# EAGLE design BeagleCap (EAGLE 6.4)
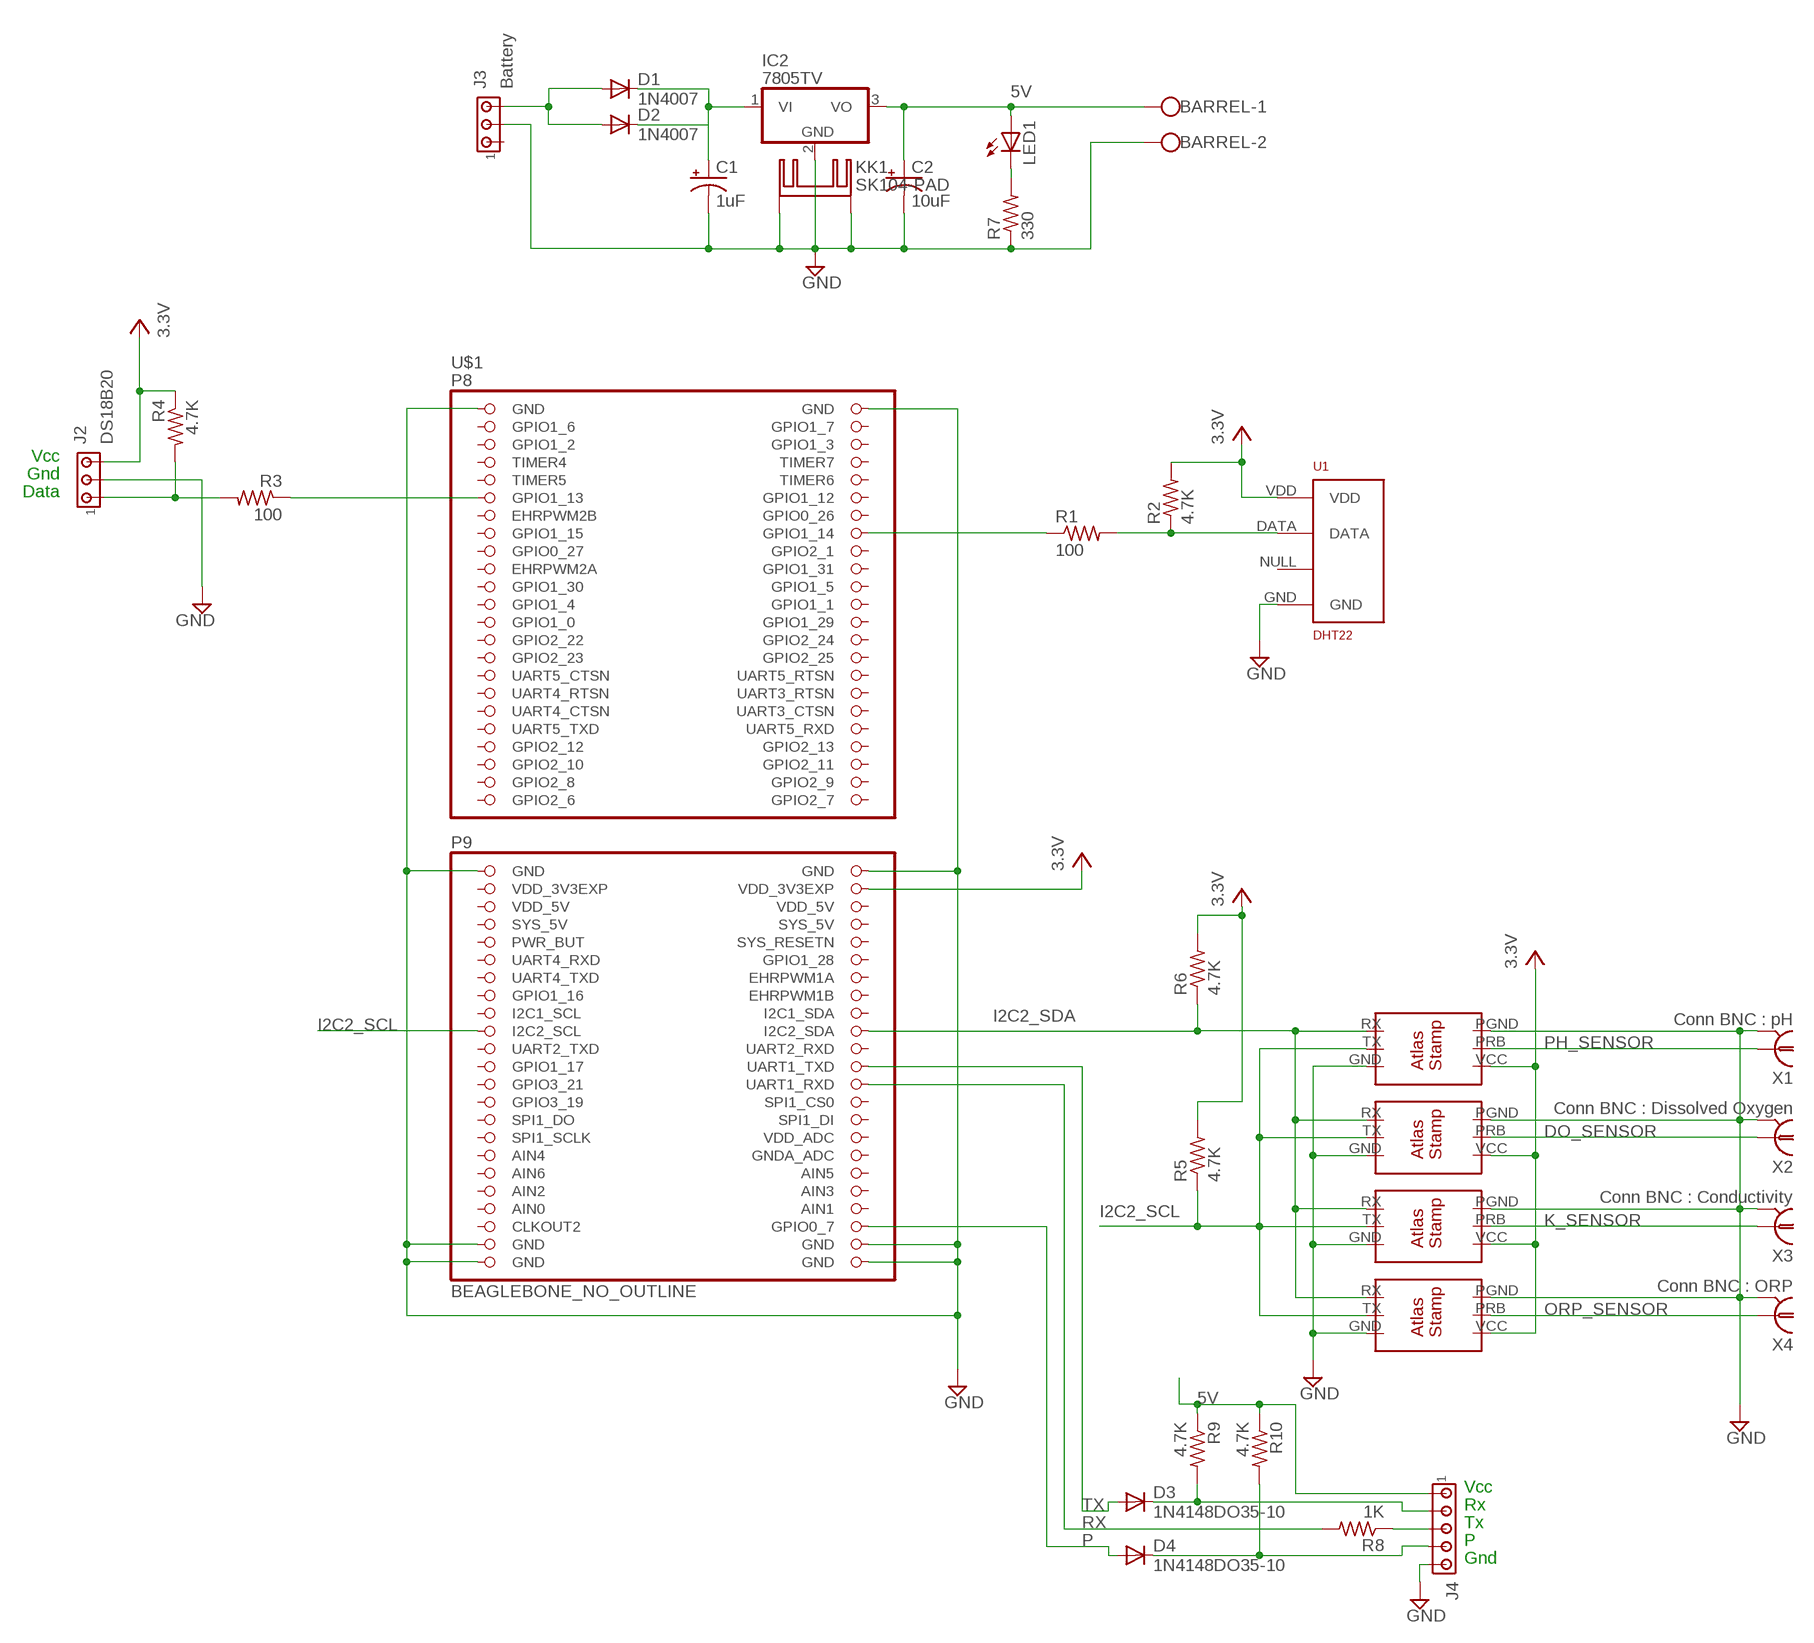
[diagram p0: schematic, sheet 1]

## Parts
BARREL  W237-102  [W237-102]
C1  1uF  CPOL-USE2-5  [E2-5]
C2  10uF  CPOL-USE2-5  [E2-5]
D1  1N4007  1N4004  [DO41-10]
D2  1N4007  1N4004  [DO41-10]
D3  1N4148DO35-10  [DO35-10]
D4  1N4148DO35-10  [DO35-10]
IC2  7805TV  [TO220V]
J2  DS18B20  MTA03-100  [10X03MTA]
J3  Battery  MTA03-100  [10X03MTA]
J4  MTA05-100  [10X05MTA]
KK1  SK104-PAD  [SK104-PAD]
LED1  LED5MM  [LED5MM]
R1  100  R-US_0207/10  [0207/10]
R2  4.7K  R-US_0207/10  [0207/10]
R3  100  R-US_0207/10  [0207/10]
R4  4.7K  R-US_0207/10  [0207/10]
R5  4.7K  R-US_0207/10  [0207/10]
R6  4.7K  R-US_0207/10  [0207/10]
R7  330  R-US_0207/10  [0207/10]
R8  1K  R-US_0207/10  [0207/10]
R9  4.7K  R-US_0207/10  [0207/10]
R10  4.7K  R-US_0207/10  [0207/10]
U1  DHT22  RHT03_DHT-22_AM2302WIRED  [AM2302]
U$1  BEAGLEBONE_NO_OUTLINE  [BEAGLEBONE_SHIELD_NO_OUTLINE]
U$2  ATLAS_STAMP  [ATLAS_STAMP]
U$3  ATLAS_STAMP  [ATLAS_STAMP]
U$4  ATLAS_STAMP  [ATLAS_STAMP]
U$5  ATLAS_STAMP  [ATLAS_STAMP]
X1  Conn BNC : pH  1-227161-0  [AMP_227161]
X2  Conn BNC : Dissolved Oxygen  1-227161-0  [AMP_227161]
X3  Conn BNC : Conductivity  1-227161-0  [AMP_227161]
X4  Conn BNC : ORP  1-227161-0  [AMP_227161]

## Nets
3.3V: J2.3 R2.2 R4.1 R5.2 R6.2 U1.VDD U$1.50(VDD_3V3EXP) U$2.VCC U$3.VCC U$4.VCC U$5.VCC
5V: BARREL.1 C2.+ IC2.3(VO) J4.1 LED1.A R9.1 R10.1
DO_SENSOR: U$3.PRB X2.1
GND: BARREL.2 C1.- C2.- IC2.2(GND) J2.2 J3.2 J4.5 KK1.K1(K) KK1.K2(K) R7.1 U1.GND U$1.1(GND) U$1.2(GND) U$1.47(GND) U$1.48(GND) U$1.89(GND) U$1.90(GND) U$1.91(GND) U$1.92(GND) U$2.GND U$2.PGND U$3.GND U$3.PGND U$4.GND U$4.PGND U$5.GND U$5.PGND X1.2 X2.2 X3.2 X4.2
I2C2_SCL: R5.1 U$1.65(I2C2_SCL) U$2.TX U$3.TX U$4.TX U$5.TX
I2C2_SDA: R6.1 U$1.66(I2C2_SDA) U$2.RX U$3.RX U$4.RX U$5.RX
K_SENSOR: U$4.PRB X3.1
N$1: D1.A D2.A J3.3
N$2: LED1.K(C) R7.2
N$3: R1.2 R2.1 U1.DATA
N$4: R3.1 U$1.11(GPIO1_13)
N$5: J2.1 R3.2 R4.2
N$6: R1.1 U$1.16(GPIO1_14)
N$9: D3.C J4.2 R9.2
N$10: J4.3 R8.1
N$11: D4.C J4.4 R10.2
ORP_SENSOR: U$5.PRB X4.1
P: D4.A U$1.88(GPIO0_7)
PH_SENSOR: U$2.PRB X1.1
RX: R8.2 U$1.72(UART1_RXD)
TX: D3.A U$1.70(UART1_TXD)
VIN: C1.+ D1.C D2.C IC2.1(VI)
Unconnected: J3.1 U1.NULL U$1.3(GPIO1_6) U$1.4(GPIO1_7) U$1.5(GPIO1_2) U$1.6(GPIO1_3) U$1.7(TIMER4) U$1.8(TIMER7) U$1.9(TIMER5) U$1.10(TIMER6) U$1.12(GPIO1_12) U$1.13(EHRPWM2B) U$1.14(GPIO0_26) U$1.15(GPIO1_15) U$1.17(GPIO0_27) U$1.18(GPIO2_1) U$1.19(EHRPWM2A) U$1.20(GPIO1_31) U$1.21(GPIO1_30) U$1.22(GPIO1_5) U$1.23(GPIO1_4) U$1.24(GPIO1_1) U$1.25(GPIO1_0) U$1.26(GPIO1_29) U$1.27(GPIO2_22) U$1.28(GPIO2_24) U$1.29(GPIO2_23) U$1.30(GPIO2_25) U$1.31(UART5_CTSN) U$1.32(UART5_RTSN) U$1.33(UART4_RTSN) U$1.34(UART3_RTSN) U$1.35(UART4_CTSN) U$1.36(UART3_CTSN) U$1.37(UART5_TXD) U$1.38(UART5_RXD) U$1.39(GPIO2_12) U$1.40(GPIO2_13) U$1.41(GPIO2_10) U$1.42(GPIO2_11) U$1.43(GPIO2_8) U$1.44(GPIO2_9) U$1.45(GPIO2_6) U$1.46(GPIO2_7) U$1.54(SYS_5V) U$1.55(PWR_BUT) U$1.56(SYS_RESETN) U$1.57(UART4_RXD) U$1.58(GPIO1_28) U$1.59(UART4_TXD) U$1.60(EHRPWM1A) U$1.61(GPIO1_16) U$1.62(EHRPWM1B) U$1.63(I2C1_SCL) U$1.64(I2C1_SDA) U$1.67(UART2_TXD) U$1.68(UART2_RXD) U$1.69(GPIO1_17) U$1.71(GPIO3_21) U$1.73(GPIO3_19) U$1.74(SPI1_CS0) U$1.75(SPI1_DO) U$1.76(SPI1_DI) U$1.77(SPI1_SCLK) U$1.78(VDD_ADC) U$1.79(AIN4) U$1.80(GNDA_ADC) U$1.81(AIN6) U$1.82(AIN5) U$1.83(AIN2) U$1.84(AIN3) U$1.86(AIN1) U$1.87(CLKOUT2)

## Notes on the sheet
- Vcc
- Gnd
- Data
- Vcc
- Rx
- Tx
- P
- Gnd

## Power pins joined to a net without a drawn wire
AIN0: U$1.85(AIN0)
SYS_5V: U$1.53(SYS_5V)
VDD_3V3EXP: U$1.49(VDD_3V3EXP)
VDD_5V: U$1.51(VDD_5V) U$1.52(VDD_5V)

## Library data of the parts
BARREL = con-wago-500:W237-102: WAGO SCREW CLAMP; MPN: 237-102; OC_FARNELL: unknown; OC_NEWARK: 70K9898
C1 C2 = rcl:CPOL-US: POLARIZED CAPACITOR, American symbol
D1 D2 = diode:1N4004: DIODE general purpose rectifier, 1 A
D3 D4 = diode:1N4148: DIODE high speed (Philips)
IC2 = linear:78*: Positive VOLTAGE REGULATOR Source: http://cache.national.com/ds/LM/LM78L05.pdf http://www.fairchildsemi.com/ds/LM/LM7805.pdf
J2 J3 = con-amp:MTA03-100: AMP connector
J4 = con-amp:MTA05-100: AMP connector
KK1 = heatsink:SK104-PAD: HEATSINK manufacturer Fischer/distributor Buerklin
LED1 = led:LED: LED OSRAM: - CHIPLED LG R971, LG N971, LY N971, LG Q971, LY Q971, LO R971, LY R971 LH N974, LH R974 LS Q976, LO Q976, LY Q976 LO Q996 - Hyper CHIPLED LW Q18S LB Q993, LB Q99A, LB R99A - SideLED LS A670, LO A670, LY A670, LG A670, LP A670 LB A673, LV A673, LT A673, LW A673 LH A674 LY A675 LS A676, LA A676, LO A676, LY A676, LW A676 LS A679, LY A679, LG A679 - Hyper Micro SIDELED® LS Y876, LA Y876, LO Y876, LY Y876 LT Y87S - SmartLED LW L88C, LW L88S LB L89C, LB L89S, LG L890 LS L89K, LO L89K, LY L89K LS L896, LA L896, LO L896, LY L896 - TOPLED LS T670, LO T670, LY T670, LG T670, LP T670 LSG T670, LSP T670, LSY T670, LOP T670, LYG T670 LG T671, LOG T671, LSG T671 LB T673, LV T673, LT T673, LW T673 LH T674 LS T676, LA T676, LO T676, LY T676, LB T676, LH T676, LSB T676, LW T676 LB T67C, LV T67C, LT T67C, LS T67K, LO T67K, LY T67K, LW E67C LS E67B, LA E67B, LO E67B, LY E67B, LB E67C, LV E67C, LT E67C LW T67C LS T679, LY T679, LG T679 LS T770, LO T770, LY T770, LG T770, LP T770 LB T773, LV T773, LT T773, LW T773 LH T774 LS E675, LA E675, LY E675, LS T675 LS T776, LA T776, LO T776, LY T776, LB T776 LHGB T686 LT T68C, LB T68C - Hyper Mini TOPLED® LB M676 - Mini TOPLED Santana® LG M470 LS M47K, LO M47K, LY M47K Source: http://www.osram.convergy.de LUXEON: - LUMILED® LXK2-PW12-R00, LXK2-PW12-S00, LXK2-PW14-U00, LXK2-PW14-V00 LXK2-PM12-R00, LXK2-PM12-S00, LXK2-PM14-U00 LXK2-PE12-Q00, LXK2-PE12-R00, LXK2-PE12-S00, LXK2-PE14-T00, LXK2-PE14-U00 LXK2-PB12-K00, LXK2-PB12-L00, LXK2-PB12-M00, LXK2-PB14-N00, LXK2-PB14-P00, LXK2-PB14-Q00 LXK2-PR12-L00, LXK2-PR12-M00, LXK2-PR14-Q00, LXK2-PR14-R00 LXK2-PD12-Q00, LXK2-PD12-R00, LXK2-PD12-S00 LXK2-PH12-R00, LXK2-PH12-S00 LXK2-PL12-P00, LXK2-PL12-Q00, LXK2-PL12-R00 Source: www.luxeon.com KINGBRIGHT: KA-3528ASYC Source: www.kingbright.com
R1-R10 = adafruit:R-US_: RESISTOR, American symbol
U1 = RHT03_DHT-22_AM2302:RHT03_DHT-22_AM2302: RHT03 / DHT-22 / AM2302 Packages and symbol for the RHT03 / DHT-22 relative humidity and temperature sensor. Note: The AM2302 is a wired version of the DHT-22 which typically requires less clearance and is thus provided as a separate package.; PROD_ID: SEN-10167
U$1 = LEDscape:BEAGLEBONE_NO_OUTLINE: Should match A3 pinout - but not completely tested
U$2-U$5 = LEDscape:ATLAS_STAMP
X1-X4 = con-coax:?227161*: JACK, RIGHT ANGLE, 50 OHM, PCB, BNC Source: amp_227161.pdf; MF: TYCO ELECTRONICS; MPN: 1-227161; OC_FARNELL: unknown; OC_NEWARK: 33B3200

## Board
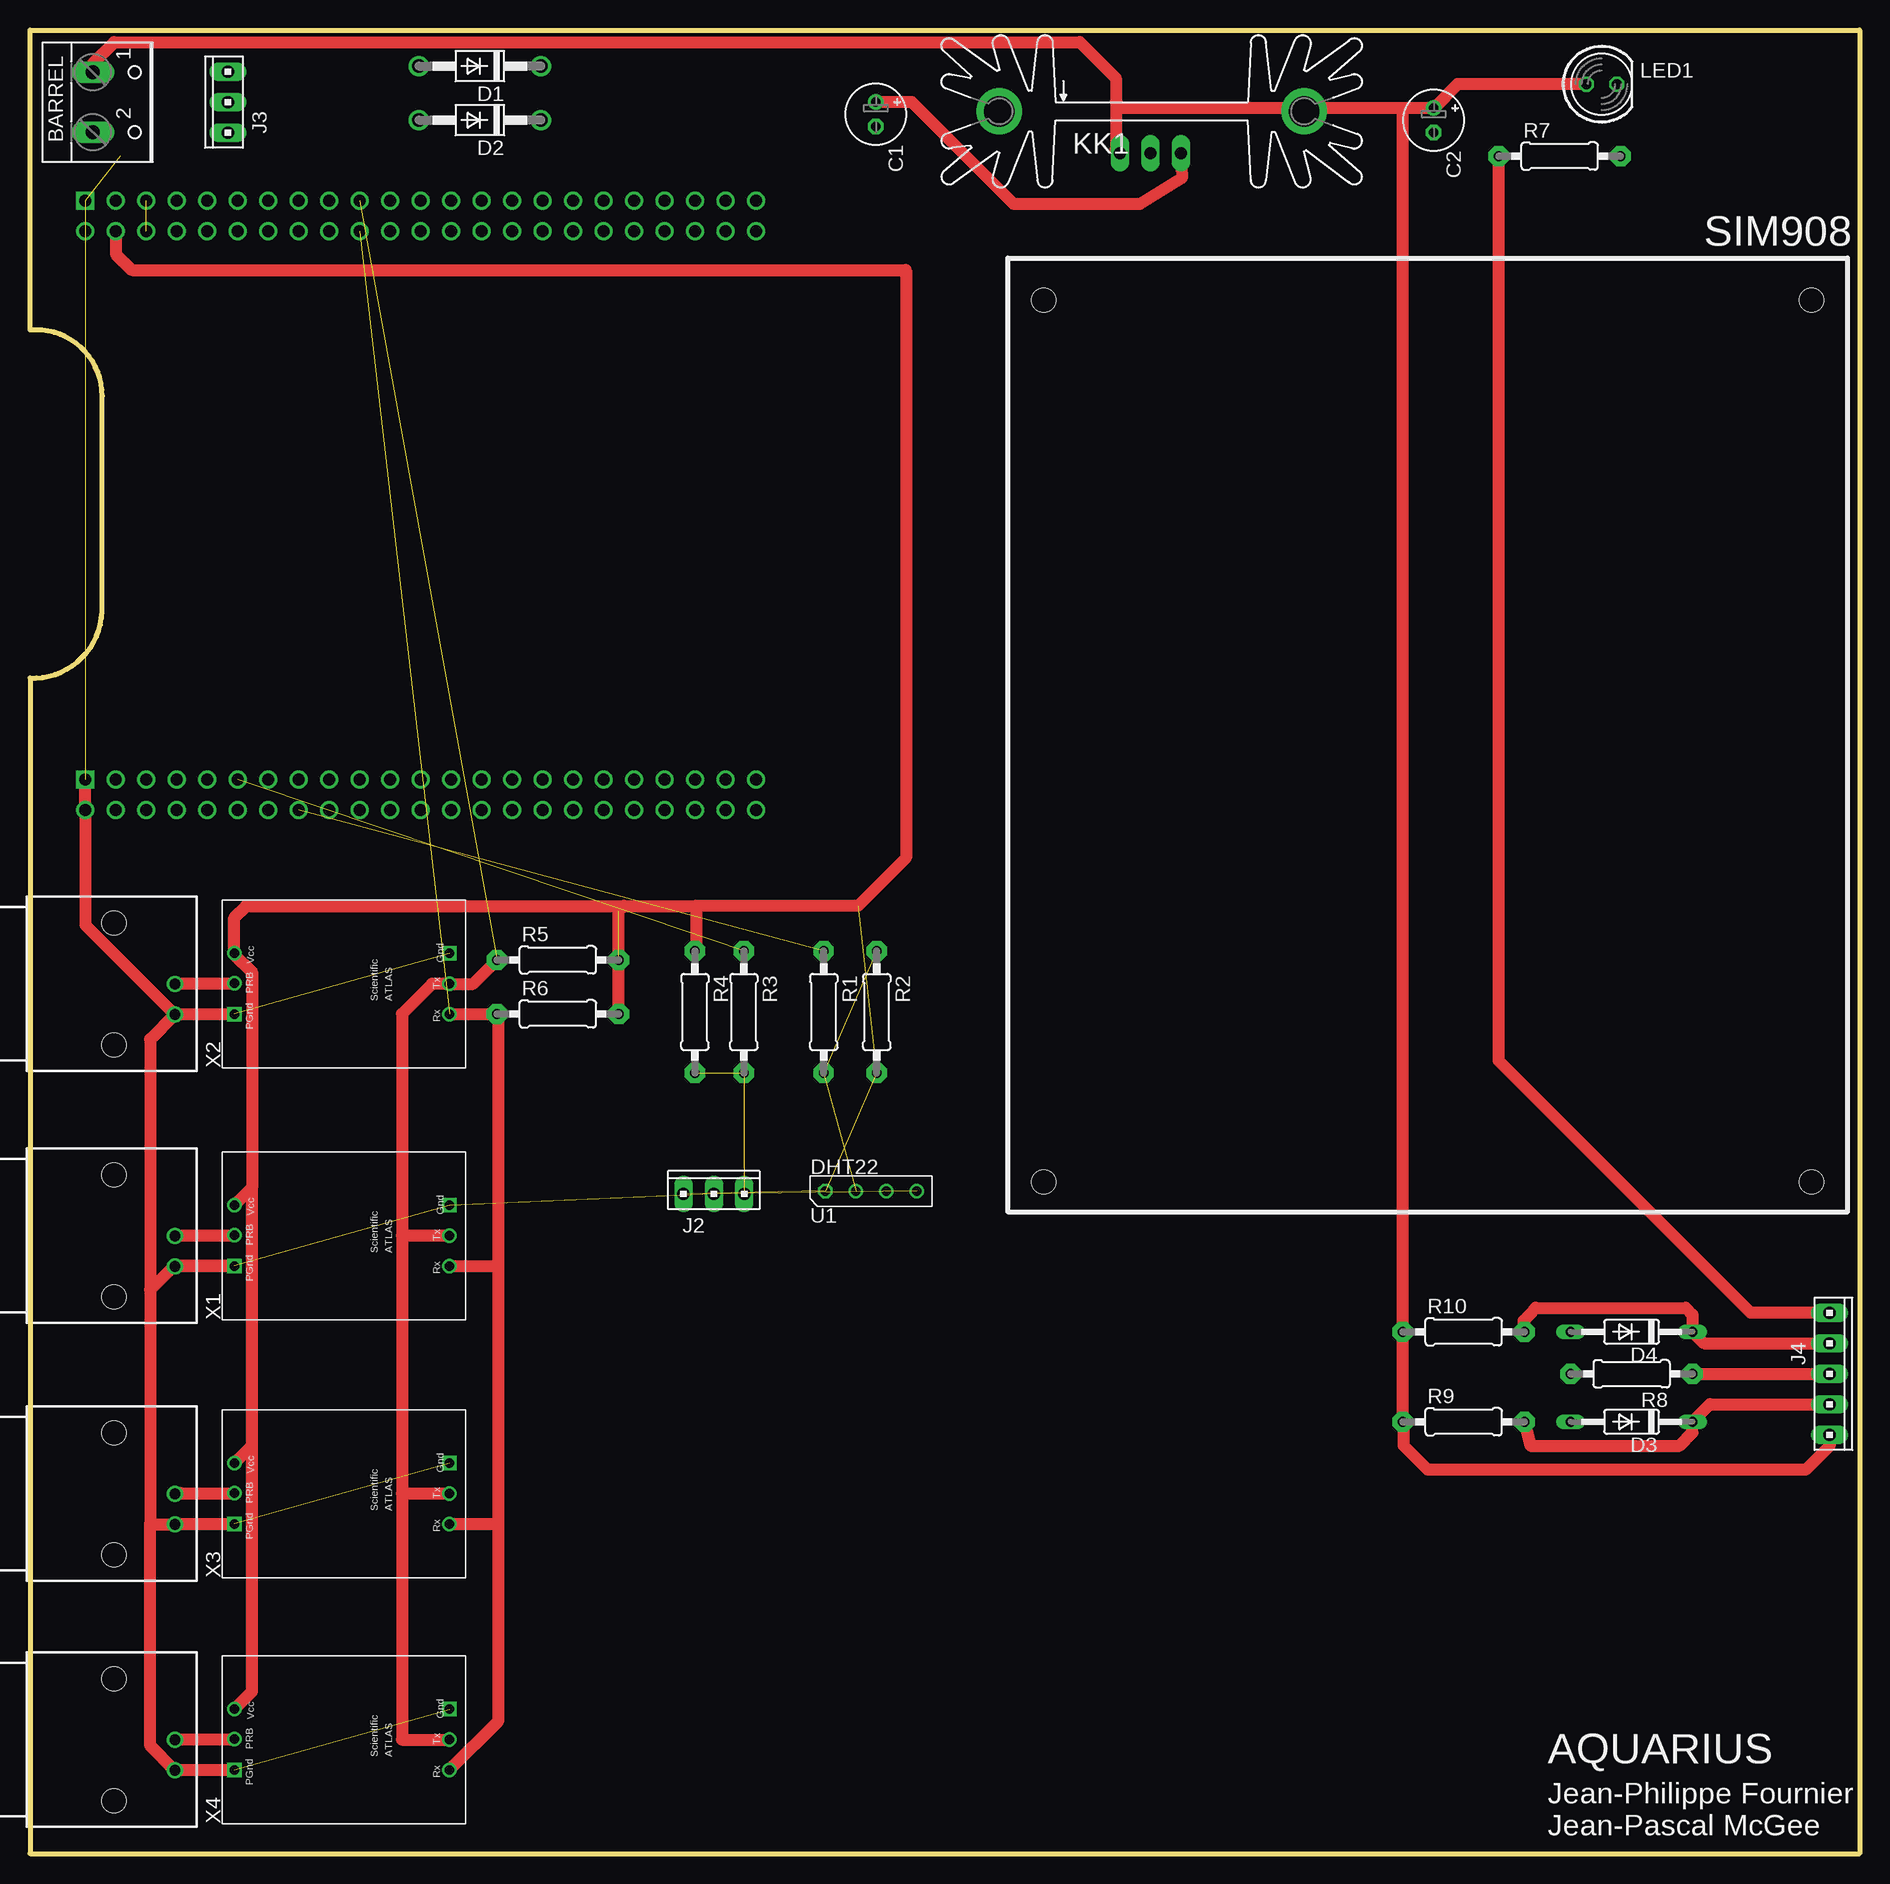
[diagram p1: board, top side]
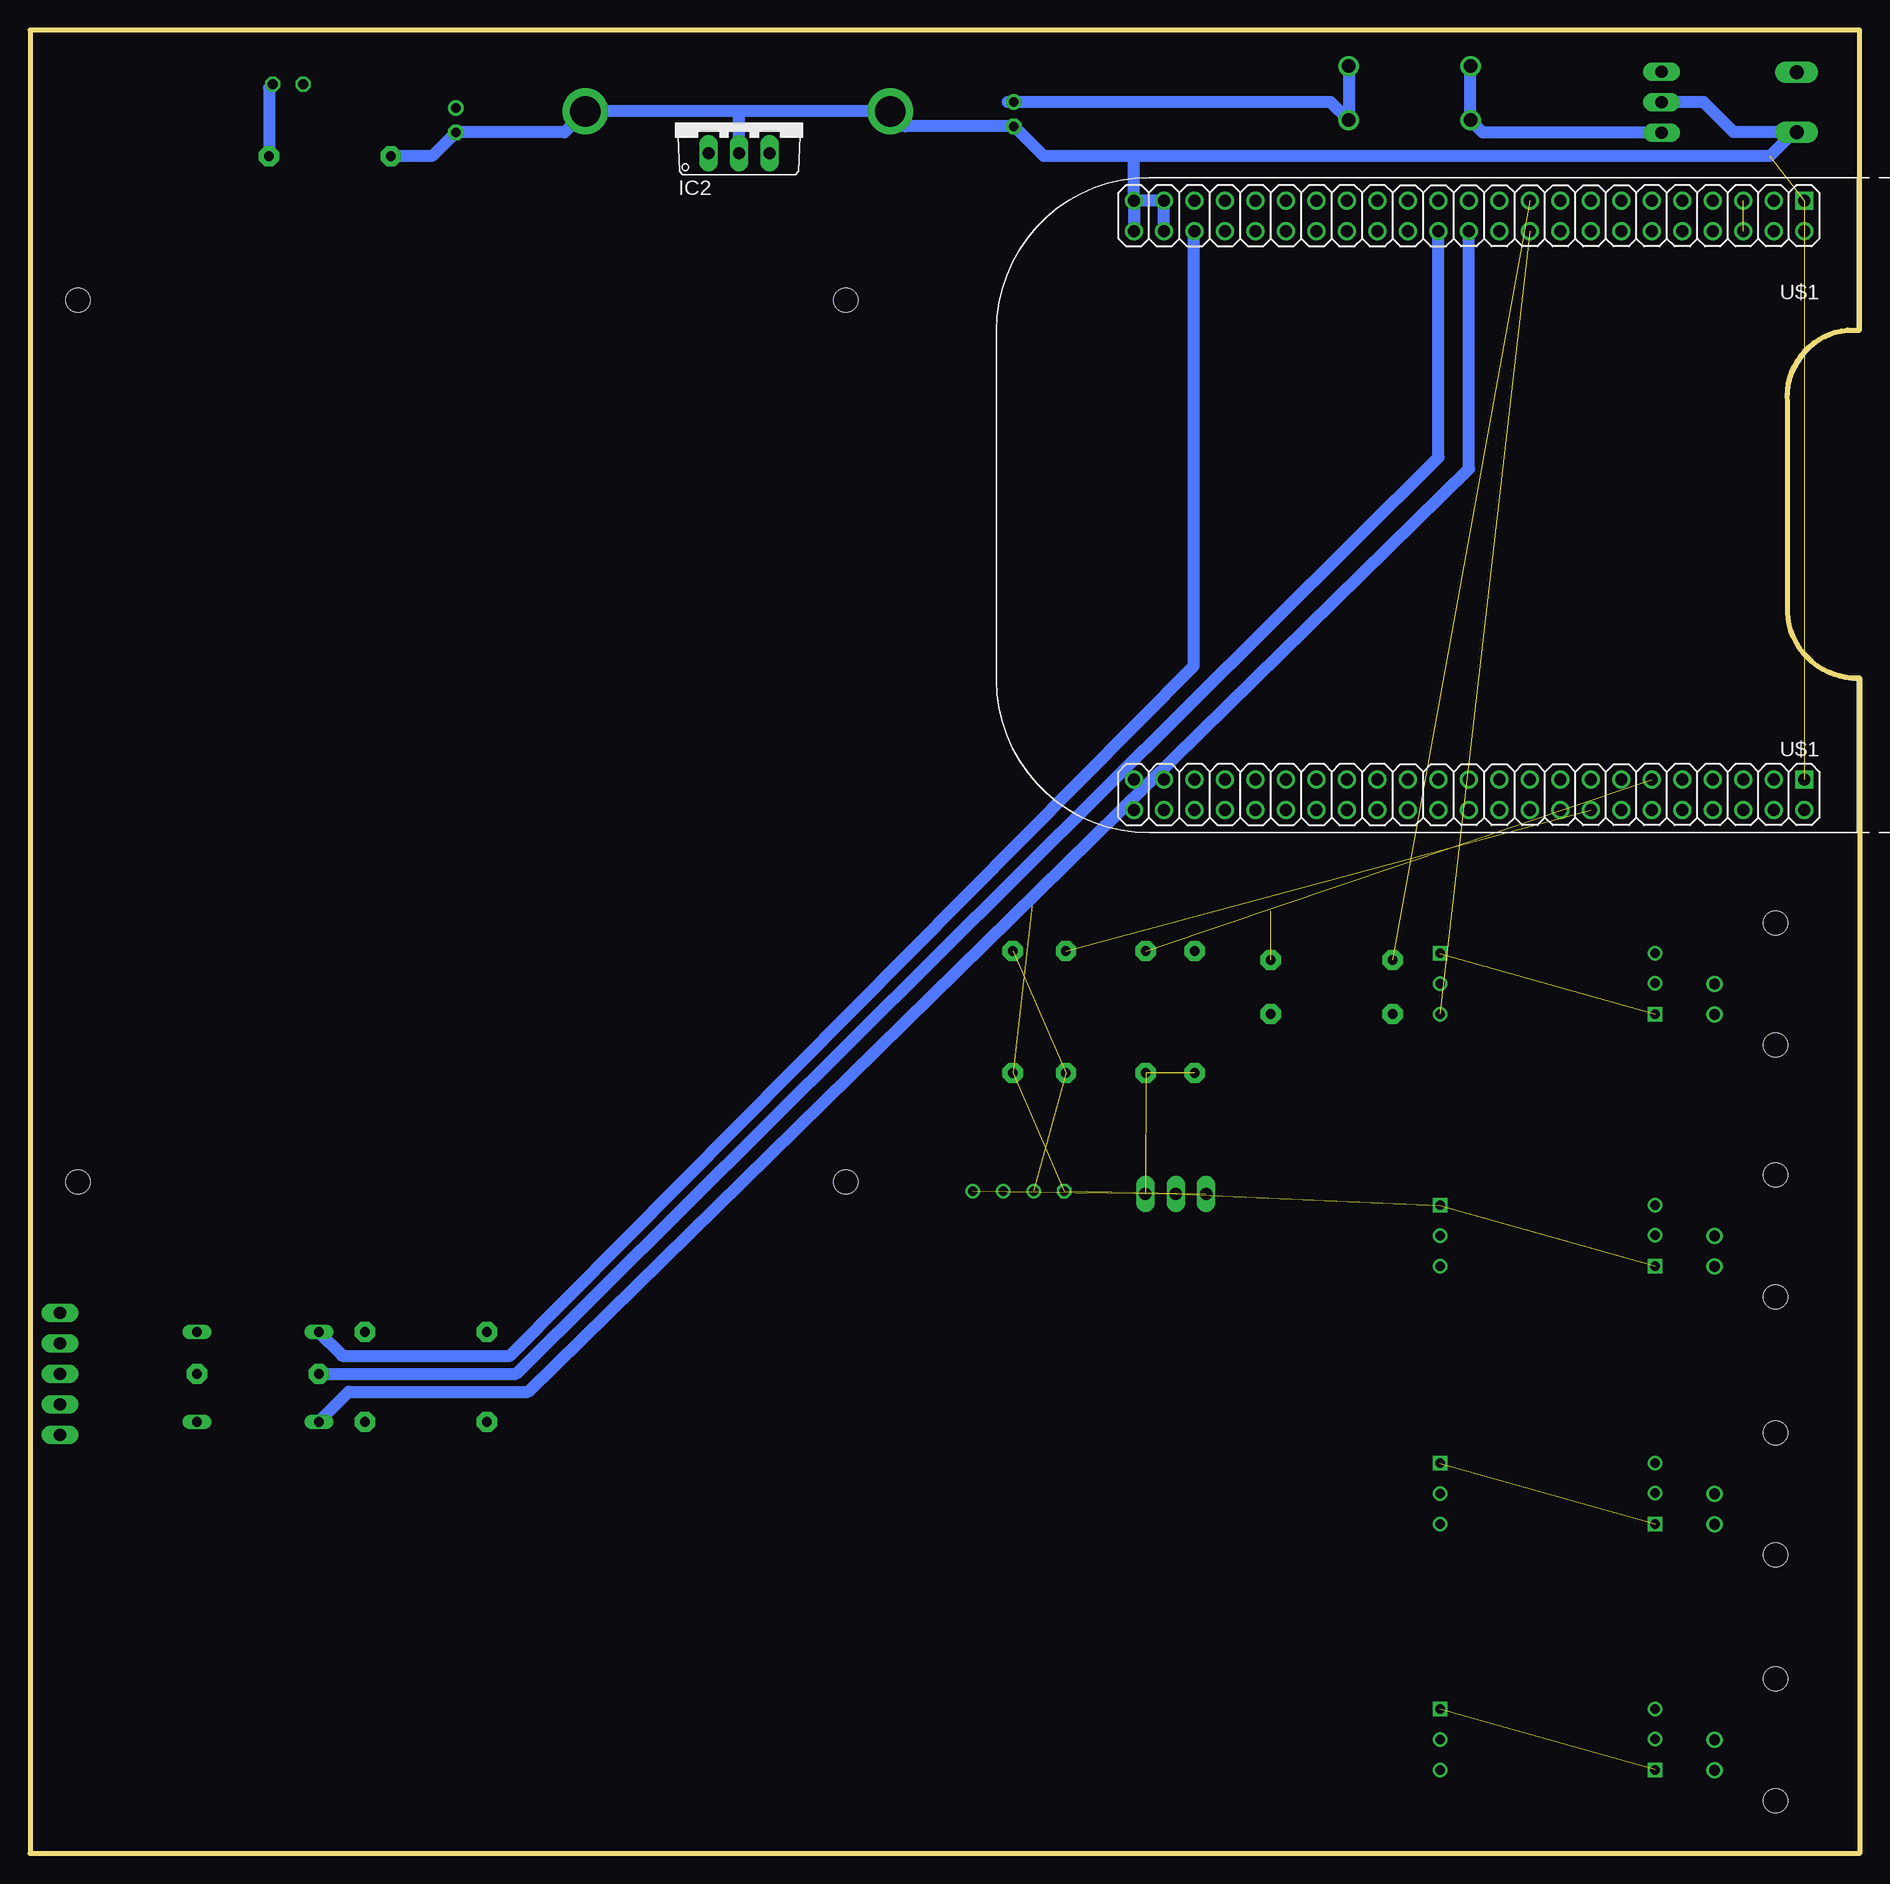
[diagram p2: board, bottom side, seen from below]

Size 152.5 x 152 mm. Coordinates in mm from the lower left corner, seen from the top.
Outline: 0,152 152.5,152 152.5,0 0,0 0,98 arc90 6,103.5 6,121 arc90 1,127 0,127 0,152
Copper layers (1*16): Top 0.0356mm / dielectric 1.5011mm / Bottom 0.0356mm
Design rules "oshpark-2layer": minimum track width 6mil, minimum drill 13mil, track to track 6mil, track to pad 6mil, pad to pad 6mil, via to via 6mil, smd to smd 6mil, copper to edge 15mil, drill to drill 6mil, minimum pad ring 7mil, minimum via ring 7mil, stop-mask expansion 4mil, vias tented up to drill 0mil, thermal gap 10mil
Holes 2 mm at 84.5,56 148.5,56 148.5,129.5 84.5,129.5

### Footprints (pad centres in the part's own frame; a part is rotated, then mirrored left to right if it is on the bottom)
W237-102 = drill 1.194 long: 1 -2.5,-1.27; 2 2.5,-1.27
E2-5 = drill 0.813 pad 1.27: + -1.016,0 | drill 0.813 pad 1.27 octagon: - 1.016,0
DO41-10 = drill 1.118: A 5.08,0; C -5.08,0
DO35-10 = drill 0.813 long: A 5.08,0; C -5.08,0
TO220V = drill 1.016 long: 1 -2.54,-2.54; 2 0,-2.54; 3 2.54,-2.54
10X03MTA = drill 1.016 long: 1 2.54,0; 2 0,0; 3 -2.54,0
10X05MTA = drill 1.016 long: 1 5.08,0; 2 2.54,0; 3 0,0; 4 -2.54,0; 5 -5.08,0
SK104-PAD = drill 2.54 pad 3.81: K1 -12.7,-0.762; K2 12.7,-0.762
LED5MM = drill 0.813 octagon: A -1.27,0; K 1.27,0
0207/10 = drill 0.813 pad 1.676 octagon: 1 -5.08,0; 2 5.08,0
AM2302 = drill 0.8: DATA -1.27,0; GND 3.81,0; NULL 1.27,0 | drill 0.8 octagon: VDD -3.81,0
BEAGLEBONE_SHIELD_NO_OUTLINE = drill 1 square: 1 4.445,19.05; 47 52.705,19.05 | drill 1: 2 1.905,19.05; 3 4.445,21.59; 4 1.905,21.59; 5 4.445,24.13; 6 1.905,24.13; 7 4.445,26.67; 8 1.905,26.67; 9 4.445,29.21; 10 1.905,29.21; 11 4.445,31.75; 12 1.905,31.75; 13 4.445,34.29; 14 1.905,34.29; 15 4.445,36.83; 16 1.905,36.83; 17 4.445,39.37; 18 1.905,39.37; 19 4.445,41.91; 20 1.905,41.91; 21 4.445,44.45; 22 1.905,44.45; 23 4.445,46.99; 24 1.905,46.99; 25 4.445,49.53; 26 1.905,49.53; 27 4.445,52.07; 28 1.905,52.07; 29 4.445,54.61; 30 1.905,54.61; 31 4.445,57.15; 32 1.905,57.15; 33 4.445,59.69; 34 1.905,59.69; 35 4.445,62.23; 36 1.905,62.23; 37 4.445,64.77; 38 1.905,64.77; 39 4.445,67.31; 40 1.905,67.31; 41 4.445,69.85; 42 1.905,69.85; 43 4.445,72.39; 44 1.905,72.39; 45 4.445,74.93; 46 1.905,74.93; 48 50.165,19.05; 49 52.705,21.59; 50 50.165,21.59; 51 52.705,24.13; 52 50.165,24.13; 53 52.705,26.67; 54 50.165,26.67; 55 52.705,29.21; 56 50.165,29.21; 57 52.705,31.75; 58 50.165,31.75; 59 52.705,34.29; 60 50.165,34.29; 61 52.705,36.83; 62 50.165,36.83; 63 52.705,39.37; 64 50.165,39.37; 65 52.705,41.91; 66 50.165,41.91; 67 52.705,44.45; 68 50.165,44.45; 69 52.705,46.99; 70 50.165,46.99; 71 52.705,49.53; 72 50.165,49.53; 73 52.705,52.07; 74 50.165,52.07; 75 52.705,54.61; 76 50.165,54.61; 77 52.705,57.15; 78 50.165,57.15; 79 52.705,59.69; 80 50.165,59.69; 81 52.705,62.23; 82 50.165,62.23; 83 52.705,64.77; 84 50.165,64.77; 85 52.705,67.31; 86 50.165,67.31; 87 52.705,69.85; 88 50.165,69.85; 89 52.705,72.39; 90 50.165,72.39; 91 52.705,74.93; 92 50.165,74.93
ATLAS_STAMP = drill 0.8 square: GND 4.445,18.97; PGND 9.525,1.03 | drill 0.8: PRB 6.95,1.03; RX 9.525,18.97; TX 6.985,18.97; VCC 4.445,1.03
AMP_227161 = drill 0.9 pad 1.27: 1 0,-5.08; 2 -2.54,-5.08 | hole 2: -5.08,0; 5.08,0

### Placement (x,y rotation side)
BARREL  6.5,146 270 top
C1  70.5,145 270 top
C2  117,144.5 270 top
D1  37.5,149 180 top
D2  37.5,144.5 180 top
D3  133.5,36 180 top
D4  133.5,43.5 180 top
IC2  93.39,144.29 0 bottom
J2  57,55 0 top
J3  16.5,146 90 top
J4  150,40 270 top
KK1  93.5,146 0 top
LED1  131,147.5 0 top
R1  66.16,70.16 270 top
R2  70.58,70.16 270 top
R3  59.5,70.16 270 top
R4  55.42,70.16 270 top
R5  44,74.5 0 top
R6  44,70 0 top
R7  127.5,141.5 0 top
R8  133.5,40 180 top
R9  119.5,36 0 top
R10  119.5,43.5 0 top
U1  70.11,55.24 0 top
U$1  -14.43,85.1 90 bottom
U$2  16,58.5 270 top
U$3  16,79.5 270 top
U$4  16,37 270 top
U$5  16,16.5 270 top
X1  7,51.5 90 top
X2  7,72.5 90 top
X3  7,30 90 top
X4  7,9.5 90 top

### Tracks (layer width: path | path; a pad name or v marks a point on that pad's centre or on a via)
3.3V  (4 unrouted)
  Top 1.016: U$1.50 7.16,133.34 8.5,132 73,132 73,83 69,79 55.5,79 | 55.5,79 55.5,75.32 R4.1 | R6.2 49.08,78.58 49.5,79 | 49.5,79 55.5,79 | 49.5,79 18,79 17.03,78.03 U$3.VCC 17.03,74.97 18.5,73.5 18.5,55.52 | 18.5,55.52 U$2.VCC | U$4.VCC 18.5,34.02 | 18.5,34.02 18.5,55.52 | U$5.VCC 18.5,13.52 18.5,34.02
5V
  Top 1.016: BARREL.1 5.23,149.23 7,151 87.5,151 90.5,148 90.5,146 | 90.5,146 90.5,142.1 IC2.3 | LED1.A 118.98,147.5 C2.+ 114.5,145.52 | 114.5,145.52 90.98,145.52 90.5,146 | 114.5,145.52 114.42,145.44 R10.1 R9.1 114.5,35.92 114.5,34 116.5,32 148,32 150,34 J4.1
DO_SENSOR
  Top 1.016: X2.1 12.13,72.55 U$3.PRB
GND  (9 unrouted)
  Top 1.016: J4.5 143.42,45.08 122.42,66.08 R7.1 | X2.2 12.09,69.97 U$3.PGND | X1.2 12.09,48.98 U$2.PGND 17.01,49 12,49 10,47 | U$4.PGND 12.59,27.48 X3.2 10.04,27.46 10,27.5 | U$5.PGND 12.09,6.98 X4.2 10,9.04 10,27.5 | U$1.1 U$1.2 4.62,77.42 X2.2 | 10,47 10,27.5 | X2.2 10,67.88 10,47
  Bottom 1.016: 5.5,143.5 10.5,143.5 13,146 J3.2 | BARREL.2 5.5,143.5 | 5.5,143.5 7.5,141.5 60.5,141.5 | 60.5,141.5 68,141.5 70.48,143.98 C1.- 79.55,143.98 KK1.K1 93.5,145.24 | 93.5,145.24 KK1.K2 107.95,143.48 C2.- 118.98,141.5 R7.1 | IC2.2 93.39,145.13 93.5,145.24 | U$1.90 U$1.89 U$1.91 | U$1.91 U$1.92 | U$1.91 60.5,141.5
I2C2_SCL  (1 unrouted)
  Top 1.016: R5.1 36.94,72.52 U$3.TX 33.52,72.52 31,70 31,51.5 | 31,51.5 31,30 | 31,30 31,9.5 34.95,9.5 U$5.TX | U$4.TX 31.02,30.02 31,30 | U$2.TX 31.02,51.52 31,51.5
I2C2_SDA  (1 unrouted)
  Top 1.016: R6.1 38.9,69.97 U$3.RX 38.98,69.97 39,70 39,49 | 39,49 39,27.5 | 39,27.5 39,11.01 U$5.RX | U$4.RX 38.98,27.48 39,27.5 | U$2.RX 38.98,48.98 39,49
K_SENSOR
  Top 1.016: X3.1 12.63,30.05 U$4.PRB
N$1
  Bottom 1.016: J3.3 31.38,143.46 D2.A D1.A
N$2
  Bottom 1.016: LED1.K 132.58,147.19 R7.2
N$3  (2 unrouted)
N$4  (1 unrouted)
N$5  (2 unrouted)
N$6  (1 unrouted)
N$9
  Top 1.016: J4.2 140.04,37.46 D3.C 138.58,35.08 137.5,34 125.08,34 R9.2
N$10
  Top 1.016: R8.1 J4.3
N$11
  Top 1.016: J4.4 139.54,42.54 D4.C 138.58,44.92 138,45.5 125.5,45.5 124.5,44.42 R10.2
ORP_SENSOR
  Top 1.016: X4.1 12.13,9.55 U$5.PRB
P
  Bottom 1.016: U$1.88 55.5,135.19 55.5,99 112.5,41.5 126.5,41.5 126.5,41.58 D4.A
PH_SENSOR
  Top 1.016: X1.1 12.13,51.55 U$2.PRB
RX
  Bottom 1.016: R8.2 112,40 35.1,116.4 U$1.72
TX
  Bottom 1.016: D3.A 125.92,38.5 111,38.5 32.56,115.44 U$1.70
VDD_5V  (1 unrouted)
VIN
  Top 1.016: IC2.1 96,139.68 92.5,137.5 82,137.5 73.5,146 70.52,146 C1.+
  Bottom 1.016: D1.C D2.C 44.1,146.02 C1.+ 70.98,146.02 71,146

### Text on the board
tPlace: SIM908 | AQUARIUS | Jean-Philippe Fournier / Jean-Pascal McGee